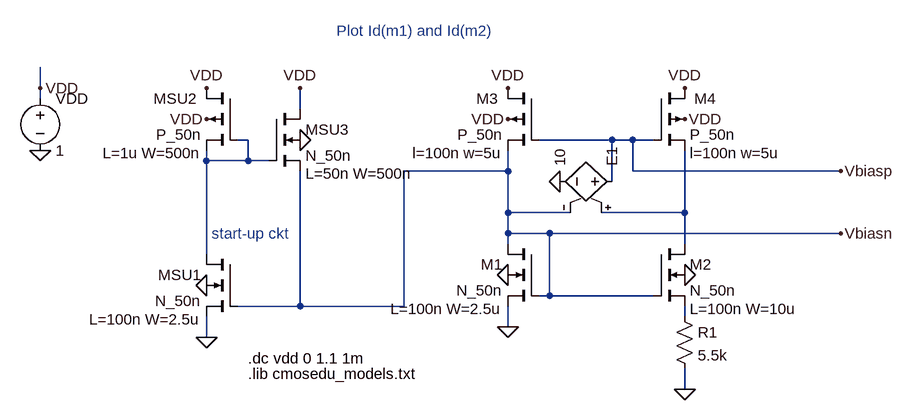
[diagram p0: schematic Fig20_20.asc]
Fig20_20.asc, the LTspice schematic file:
Version 4
SHEET 1 1652 680
WIRE 288 -176 288 -208
WIRE 288 -160 288 -176
WIRE 544 -64 544 -80
WIRE 544 80 544 -64
WIRE 544 208 544 176
WIRE 608 -96 592 -96
WIRE 608 -64 544 -64
WIRE 608 -64 608 -96
WIRE 640 -64 608 -64
WIRE 688 -144 688 -176
WIRE 688 160 592 160
WIRE 688 160 688 -48
WIRE 848 160 688 160
WIRE 848 160 848 -48
WIRE 1008 -48 848 -48
WIRE 1008 -48 1008 -80
WIRE 1008 16 1008 -48
WIRE 1008 48 1008 16
WIRE 1008 64 1008 48
WIRE 1008 192 1008 160
WIRE 1072 48 1008 48
WIRE 1072 144 1056 144
WIRE 1072 144 1072 48
WIRE 1104 16 1008 16
WIRE 1168 -96 1056 -96
WIRE 1168 -32 1168 -96
WIRE 1200 -96 1168 -96
WIRE 1200 -48 1200 -96
WIRE 1232 -96 1200 -96
WIRE 1232 144 1072 144
WIRE 1280 16 1152 16
WIRE 1280 16 1280 -80
WIRE 1280 64 1280 16
WIRE 1280 176 1280 160
WIRE 1280 288 1280 256
WIRE 1520 -48 1200 -48
WIRE 1520 48 1072 48
FLAG 288 -80 0
FLAG 288 -176 VDD
FLAG 544 -128 VDD
FLAG 544 -176 VDD
FLAG 544 208 0
FLAG 544 128 0
FLAG 688 -96 0
FLAG 688 -176 VDD
FLAG 1008 -128 VDD
FLAG 1008 -176 VDD
FLAG 1280 -128 VDD
FLAG 1280 -176 VDD
FLAG 1008 192 0
FLAG 1008 112 0
FLAG 1280 288 0
FLAG 1280 112 0
FLAG 1520 48 Vbiasn
FLAG 1088 -32 0
FLAG 1520 -48 Vbiasp
SYMBOL voltage 288 -176 R0
WINDOW 123 0 0 Left 0
WINDOW 39 0 0 Left 0
SYMATTR InstName VDD
SYMATTR Value 1
SYMBOL pmos4 592 -176 M0
WINDOW 0 63 16 Left 0
WINDOW 123 56 100 Left 0
SYMATTR InstName MSU2
SYMATTR Value2 L=1u W=500n
SYMATTR Value P_50n
SYMBOL nmos4 592 80 M0
WINDOW 123 56 100 Left 0
SYMATTR Value2 L=100n W=2.5u
SYMATTR InstName MSU1
SYMATTR Value N_50n
SYMBOL nmos4 640 -144 R0
WINDOW 123 56 100 Left 0
SYMATTR Value2 L=50n W=500n
SYMATTR InstName MSU3
SYMATTR Value N_50n
SYMBOL pmos4 1056 -176 M0
WINDOW 0 63 16 Left 0
WINDOW 123 56 100 Left 0
SYMATTR InstName M3
SYMATTR Value2 l=100n w=5u
SYMATTR Value P_50n
SYMBOL pmos4 1232 -176 R0
WINDOW 0 63 16 Left 0
WINDOW 123 56 100 Left 0
SYMATTR InstName M4
SYMATTR Value2 l=100n w=5u
SYMATTR Value P_50n
SYMBOL nmos4 1056 64 M0
WINDOW 123 56 100 Left 0
SYMATTR Value2 L=100n W=2.5u
SYMATTR InstName M1
SYMATTR Value N_50n
SYMBOL nmos4 1232 64 R0
WINDOW 123 56 100 Left 0
SYMATTR Value2 L=100n W=10u
SYMATTR InstName M2
SYMATTR Value N_50n
SYMBOL res 1264 160 R0
SYMATTR InstName R1
SYMATTR Value 5.5k
SYMBOL e 1184 -32 M270
SYMATTR InstName E1
SYMATTR Value 10
TEXT 608 264 Left 0 !.lib cmosedu_models.txt
TEXT 608 240 Left 0 !.dc vdd 0 1.1 1m
TEXT 552 48 Left 0 ;start-up ckt
TEXT 744 -264 Left 0 ;Plot Id(m1) and Id(m2)

The netlist it stands for:
* Fig20_20.asc
VDD VDD 0 1
MSU2 VDD N001 N001 VDD P_50n L=1u W=500n
MSU1 N001 Vbiasn 0 0 N_50n L=100n W=2.5u
MSU3 VDD N001 Vbiasn 0 N_50n L=50n W=500n
M3 VDD Vbiasp Vbiasn VDD P_50n l=100n w=5u
M4 VDD Vbiasp N002 VDD P_50n l=100n w=5u
M1 Vbiasn Vbiasn 0 0 N_50n L=100n W=2.5u
M2 N002 Vbiasn N003 0 N_50n L=100n W=10u
R1 N003 0 5.5k
E1 Vbiasp 0 N002 Vbiasn 10
.model NMOS NMOS
.model PMOS PMOS
.lib standard.mos
.lib cmosedu_models.txt
.dc vdd 0 1.1 1m
* start-up ckt
* Plot Id(m1) and Id(m2)
.backanno
.end